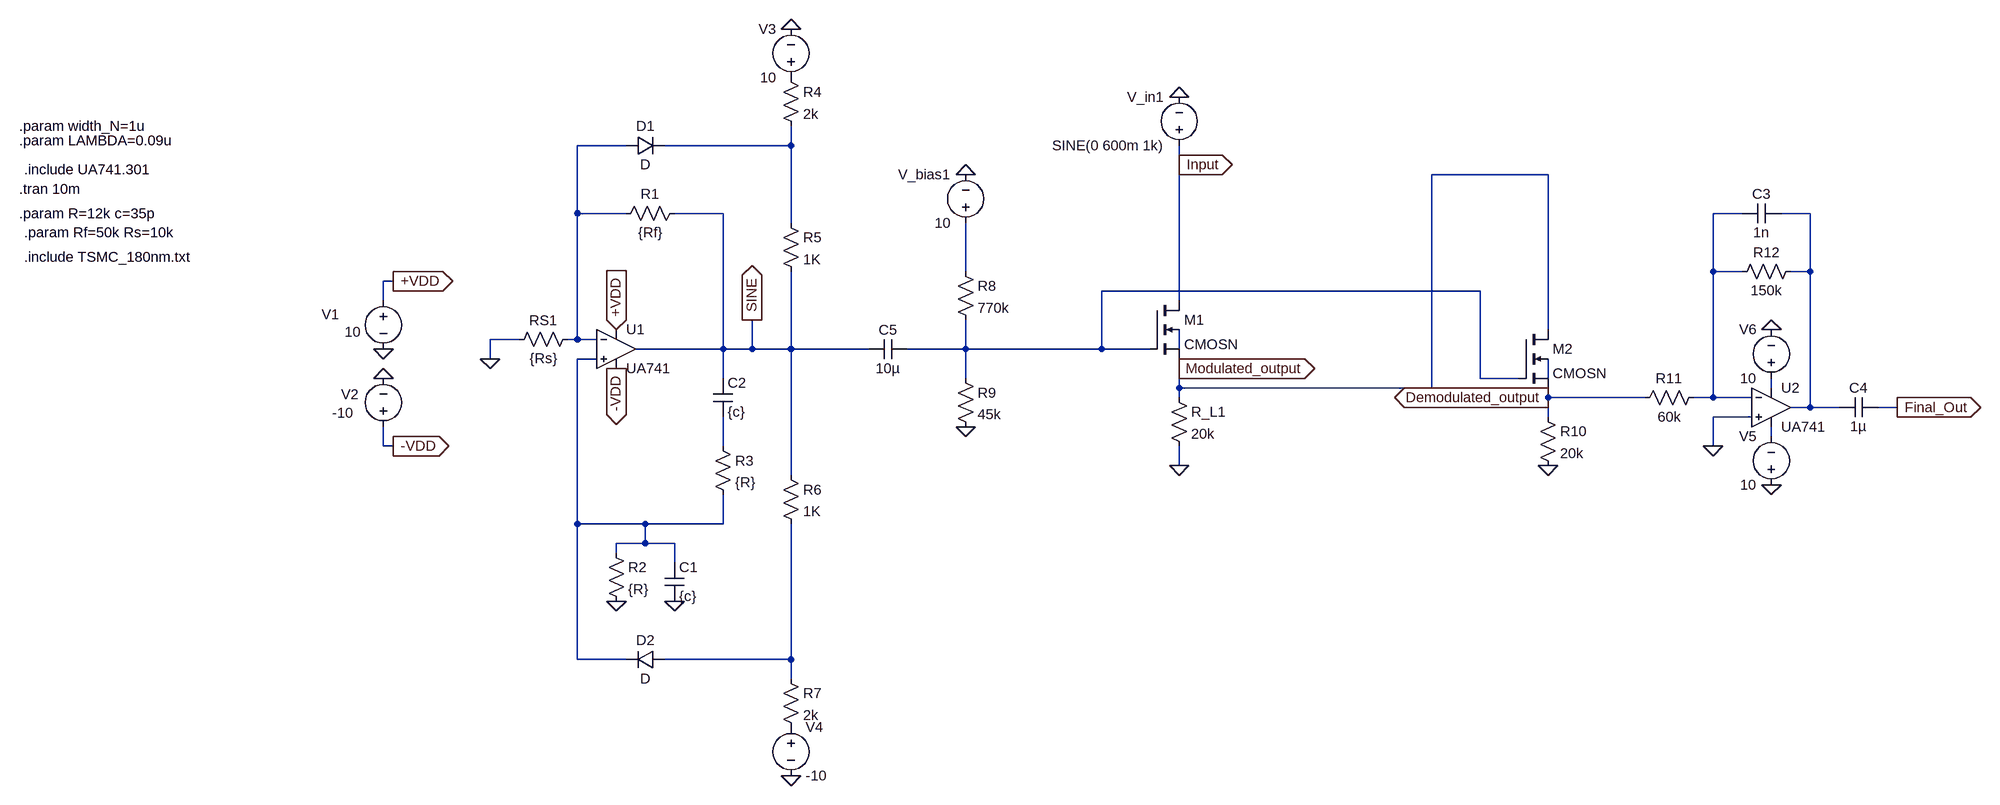
[diagram p0: schematic Updated_circuit.asc]
Updated_circuit.asc, the LTspice schematic file:
Version 4
SHEET 1 3532 884
WIRE 368 -208 288 -208
WIRE 640 -208 640 -240
WIRE 640 -208 432 -208
WIRE 1280 -176 1280 -208
WIRE 1888 -160 1696 -160
WIRE 288 -96 288 -208
WIRE 368 -96 288 -96
WIRE 528 -96 448 -96
WIRE 2208 -96 2160 -96
WIRE 2320 -96 2272 -96
WIRE 640 -80 640 -208
WIRE 928 0 928 -80
WIRE 2160 0 2160 -96
WIRE 2208 0 2160 0
WIRE 2320 0 2320 -96
WIRE 2320 0 2288 0
WIRE -16 16 -32 16
WIRE 1776 32 1152 32
WIRE -32 48 -32 16
WIRE 1280 48 1280 -176
WIRE 1888 96 1888 -160
WIRE 192 112 144 112
WIRE 288 112 288 -96
WIRE 288 112 272 112
WIRE 320 112 288 112
WIRE 528 128 528 -96
WIRE 528 128 384 128
WIRE 576 128 576 80
WIRE 576 128 528 128
WIRE 640 128 640 0
WIRE 640 128 576 128
WIRE 768 128 640 128
WIRE 928 128 928 80
WIRE 928 128 832 128
WIRE 1152 128 1152 32
WIRE 1152 128 928 128
WIRE 1232 128 1152 128
WIRE 1280 128 1280 96
WIRE 144 144 144 112
WIRE 320 144 288 144
WIRE 1280 160 1280 144
WIRE 528 176 528 128
WIRE 928 176 928 128
WIRE 1776 176 1776 32
WIRE 1840 176 1776 176
WIRE 1888 176 1888 144
WIRE 1280 192 1280 160
WIRE 1696 192 1696 -160
WIRE 1696 192 1280 192
WIRE 2256 192 2256 176
WIRE 1280 208 1280 192
WIRE 1888 208 1888 192
WIRE 2048 208 1888 208
WIRE 2160 208 2160 0
WIRE 2160 208 2128 208
WIRE 2224 208 2160 208
WIRE 2320 224 2320 0
WIRE 2320 224 2288 224
WIRE 2368 224 2320 224
WIRE 2464 224 2432 224
WIRE 1888 240 1888 208
WIRE 2224 240 2160 240
WIRE 2256 272 2256 256
WIRE -32 288 -32 256
WIRE -16 288 -32 288
WIRE 528 288 528 240
WIRE 2160 288 2160 240
WIRE 1280 320 1280 288
WIRE 640 336 640 128
WIRE 288 416 288 144
WIRE 400 416 288 416
WIRE 528 416 528 368
WIRE 528 416 400 416
WIRE 400 448 400 416
WIRE 400 448 352 448
WIRE 448 448 400 448
WIRE 352 464 352 448
WIRE 448 480 448 448
WIRE 288 640 288 416
WIRE 368 640 288 640
WIRE 640 640 640 416
WIRE 640 640 432 640
WIRE 640 672 640 640
FLAG -32 128 0
FLAG -32 176 0
FLAG -16 16 +VDD
IOPIN -16 16 Out
FLAG -16 288 -VDD
IOPIN -16 288 Out
FLAG 352 96 +VDD
IOPIN 352 96 In
FLAG 352 160 -VDD
IOPIN 352 160 Out
FLAG 144 144 0
FLAG 352 544 0
FLAG 448 544 0
FLAG 576 80 SINE
IOPIN 576 80 Out
FLAG 640 832 0
FLAG 640 -400 0
FLAG 928 256 0
FLAG 928 -160 0
FLAG 1280 -288 0
FLAG 1280 320 0
FLAG 1888 320 0
FLAG 2256 352 0
FLAG 2256 96 0
FLAG 1280 -176 Input
IOPIN 1280 -176 Out
FLAG 2464 224 Final_Out
IOPIN 2464 224 Out
FLAG 2160 288 0
FLAG 1888 208 Demodulated_output
IOPIN 1888 208 Out
FLAG 1280 160 Modulated_output
IOPIN 1280 160 Out
DATAFLAG 640 -208 ""
DATAFLAG 640 656 ""
SYMBOL voltage -32 32 R0
WINDOW 0 -102 39 Left 2
WINDOW 3 -64 68 Left 2
WINDOW 123 0 0 Left 0
WINDOW 39 0 0 Left 0
SYMATTR InstName V1
SYMATTR Value 10
SYMBOL voltage -32 272 R180
WINDOW 0 40 69 Left 2
WINDOW 3 49 39 Left 2
WINDOW 123 0 0 Left 0
WINDOW 39 0 0 Left 0
SYMATTR InstName V2
SYMATTR Value -10
SYMBOL OpAmps\\opamp2 352 64 R0
SYMATTR InstName U1
SYMATTR Value UA741
SYMBOL res 288 96 R90
WINDOW 0 0 56 VBottom 2
WINDOW 3 32 56 VTop 2
SYMATTR InstName RS1
SYMATTR Value {Rs}
SYMBOL res 464 -112 R90
WINDOW 0 0 56 VBottom 2
WINDOW 3 32 56 VTop 2
SYMATTR InstName R1
SYMATTR Value {Rf}
SYMBOL res 336 448 R0
SYMATTR InstName R2
SYMATTR Value {R}
SYMBOL cap 432 480 R0
SYMATTR InstName C1
SYMATTR Value {c}
SYMBOL res 512 272 R0
SYMATTR InstName R3
SYMATTR Value {R}
SYMBOL cap 512 176 R0
SYMATTR InstName C2
SYMATTR Value {c}
SYMBOL diode 368 -192 R270
WINDOW 0 32 32 VTop 2
WINDOW 3 0 32 VBottom 2
SYMATTR InstName D1
SYMBOL diode 432 624 R90
WINDOW 0 0 32 VBottom 2
WINDOW 3 32 32 VTop 2
SYMATTR InstName D2
SYMBOL res 624 -336 R0
SYMATTR InstName R4
SYMATTR Value 2k
SYMBOL res 624 -96 R0
SYMATTR InstName R5
SYMATTR Value 1K
SYMBOL res 624 320 R0
SYMATTR InstName R6
SYMATTR Value 1K
SYMBOL res 624 656 R0
SYMATTR InstName R7
SYMATTR Value 2k
SYMBOL voltage 640 -304 R180
WINDOW 0 24 96 Left 2
WINDOW 3 24 16 Left 2
WINDOW 123 0 0 Left 0
WINDOW 39 0 0 Left 0
SYMATTR InstName V3
SYMATTR Value 10
SYMBOL voltage 640 736 R0
WINDOW 123 0 0 Left 0
WINDOW 39 0 0 Left 0
SYMATTR InstName V4
SYMATTR Value -10
SYMBOL nmos4 1232 48 R0
SYMATTR InstName M1
SYMATTR Value CMOSN
SYMATTR Value2 l={2*LAMBDA} w={width_N} ad={5*width_ N*LAMBDA} as={5*width_ N*LAMBDA} pd={10*LAMBDA+2*width_N} ps={10*LAMBDA+2*width_N}
SYMBOL res 912 -16 R0
SYMATTR InstName R8
SYMATTR Value 770k
SYMBOL res 912 160 R0
SYMATTR InstName R9
SYMATTR Value 45k
SYMBOL voltage 928 -64 R180
WINDOW 0 24 96 Left 2
WINDOW 3 24 16 Left 2
SYMATTR InstName V_bias1
SYMATTR Value 10
SYMBOL voltage 1280 -192 R180
WINDOW 0 24 96 Left 2
WINDOW 3 24 16 Left 2
WINDOW 123 0 0 Left 0
WINDOW 39 0 0 Left 0
SYMATTR InstName V_in1
SYMATTR Value SINE(0 600m 1k)
SYMBOL res 1264 192 R0
SYMATTR InstName R_L1
SYMATTR Value 20k
SYMBOL nmos4 1840 96 R0
SYMATTR InstName M2
SYMATTR Value CMOSN
SYMATTR Value2 l={2*LAMBDA} w={width_N} ad={5*width_ N*LAMBDA} as={5*width_ N*LAMBDA} pd={10*LAMBDA+2*width_N} ps={10*LAMBDA+2*width_N}
SYMBOL res 1872 224 R0
SYMATTR InstName R10
SYMATTR Value 20k
SYMBOL OpAmps\\opamp2 2256 160 R0
SYMATTR InstName U2
SYMATTR Value UA741
SYMBOL voltage 2256 368 R180
WINDOW 0 24 96 Left 2
WINDOW 3 24 16 Left 2
WINDOW 123 0 0 Left 0
WINDOW 39 0 0 Left 0
SYMATTR InstName V5
SYMATTR Value 10
SYMBOL voltage 2256 192 R180
WINDOW 0 24 96 Left 2
WINDOW 3 24 16 Left 2
WINDOW 123 0 0 Left 0
WINDOW 39 0 0 Left 0
SYMATTR InstName V6
SYMATTR Value 10
SYMBOL res 2144 192 R90
WINDOW 0 0 56 VBottom 2
WINDOW 3 32 56 VTop 2
SYMATTR InstName R11
SYMATTR Value 60k
SYMBOL res 2304 -16 R90
WINDOW 0 0 56 VBottom 2
WINDOW 3 32 56 VTop 2
SYMATTR InstName R12
SYMATTR Value 150k
SYMBOL cap 2272 -112 R90
WINDOW 0 0 32 VBottom 2
WINDOW 3 32 32 VTop 2
SYMATTR InstName C3
SYMATTR Value 1n
SYMBOL cap 2432 208 R90
WINDOW 0 0 32 VBottom 2
WINDOW 3 32 32 VTop 2
SYMATTR InstName C4
SYMATTR Value 1µ
SYMBOL cap 832 112 R90
WINDOW 0 0 32 VBottom 2
WINDOW 3 32 32 VTop 2
SYMATTR InstName C5
SYMATTR Value 10µ
TEXT -624 -24 Left 2 !.include TSMC_180nm.txt
TEXT -632 -136 Left 2 !.tran 10m
TEXT -632 -96 Left 2 !.param R=12k c=35p
TEXT -624 -64 Left 2 !.param Rf=50k Rs=10k
TEXT -624 -168 Left 2 !.include UA741.301
TEXT -632 -240 Left 2 !.param width_N=1u
TEXT -632 -216 Left 2 !.param LAMBDA=0.09u

The netlist it stands for:
* Updated_circuit.asc
V1 +VDD 0 10
V2 -VDD 0 -10
XU1 N008 N001 +VDD -VDD SINE UA741  ; pins In+ In- V+ V- OUT
RS1 N001 0 {Rs}
R1 SINE N001 {Rf}
R2 N008 0 {R}
C1 N008 0 {c}
R3 N012 N008 {R}
C2 SINE N012 {c}
D1 N001 N002 D
D2 N013 N008 D
R4 P001 N002 2k
R5 N002 SINE 1K
R6 SINE N013 1K
R7 N013 P002 2k
V3 P001 0 10
V4 P002 0 -10
M1 Input N006 Modulated_output N007 CMOSN l={2*LAMBDA} w={width_N} ad={5*width_ N*LAMBDA} as={5*width_ N*LAMBDA} pd={10*LAMBDA+2*width_N} ps={10*LAMBDA+2*width_N}
R8 N005 N006 770k
R9 N006 0 45k
V_bias1 N005 0 10
V_in1 Input 0 SINE(0 600m 1k)
R_L1 Modulated_output 0 20k
M2 Modulated_output N006 Demodulated_output N009 CMOSN l={2*LAMBDA} w={width_N} ad={5*width_ N*LAMBDA} as={5*width_ N*LAMBDA} pd={10*LAMBDA+2*width_N} ps={10*LAMBDA+2*width_N}
R10 Demodulated_output 0 20k
XU2 0 N003 N010 N011 N004 UA741  ; pins In+ In- V+ V- OUT
V5 0 N011 10
V6 N010 0 10
R11 N003 Demodulated_output 60k
R12 N004 N003 150k
C3 N004 N003 1n
C4 Final_Out N004 1µ
C5 N006 SINE 10µ
.model D D
.lib standard.dio
.model NMOS NMOS
.model PMOS PMOS
.lib standard.mos
.include TSMC_180nm.txt
.tran 10m
.param R=12k c=35p
.param Rf=50k Rs=10k
.include UA741.301
.param width_N=1u
.param LAMBDA=0.09u
.backanno
.end